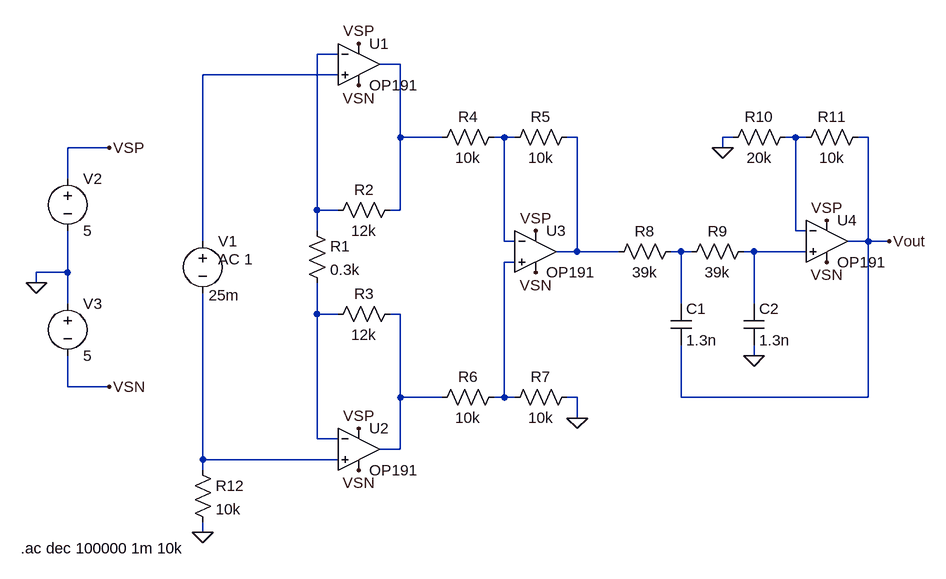
[diagram p0: schematic 323CA_Oprea_Olivia_Maria_Magdalena.asc]
323CA_Oprea_Olivia_Maria_Magdalena.asc, the LTspice schematic file:
Version 4
SHEET 1 1364 680
WIRE 352 -176 320 -176
WIRE 448 -160 416 -160
WIRE 352 -144 144 -144
WIRE 448 -48 448 -160
WIRE 512 -48 448 -48
WIRE 608 -48 592 -48
WIRE 624 -48 608 -48
WIRE 720 -48 704 -48
WIRE 960 -48 944 -48
WIRE 1056 -48 1040 -48
WIRE 1072 -48 1056 -48
WIRE 1168 -48 1152 -48
WIRE 0 -32 -64 -32
WIRE 944 -32 944 -48
WIRE -64 16 -64 -32
WIRE 320 64 320 -176
WIRE 352 64 320 64
WIRE 448 64 448 -48
WIRE 448 64 432 64
WIRE 320 96 320 64
WIRE 1056 96 1056 -48
WIRE 1072 96 1056 96
WIRE 144 112 144 -144
WIRE 608 112 608 -48
WIRE 624 112 608 112
WIRE 1168 112 1168 -48
WIRE 1168 112 1136 112
WIRE 1200 112 1168 112
WIRE 720 128 720 -48
WIRE 720 128 688 128
WIRE 784 128 720 128
WIRE 880 128 864 128
WIRE 896 128 880 128
WIRE 992 128 976 128
WIRE 1072 128 992 128
WIRE 624 144 608 144
WIRE -64 160 -64 96
WIRE -64 160 -112 160
WIRE -112 176 -112 160
WIRE -64 208 -64 160
WIRE 880 208 880 128
WIRE 992 208 992 128
WIRE 320 224 320 176
WIRE 352 224 320 224
WIRE 448 224 432 224
WIRE 992 288 992 272
WIRE -64 336 -64 288
WIRE 0 336 -64 336
WIRE 448 352 448 224
WIRE 512 352 448 352
WIRE 608 352 608 144
WIRE 608 352 592 352
WIRE 624 352 608 352
WIRE 720 352 704 352
WIRE 880 352 880 272
WIRE 1168 352 1168 112
WIRE 1168 352 880 352
WIRE 720 384 720 352
WIRE 320 416 320 224
WIRE 352 416 320 416
WIRE 448 432 448 352
WIRE 448 432 416 432
WIRE 144 448 144 192
WIRE 352 448 144 448
WIRE 144 464 144 448
WIRE 144 560 144 544
FLAG -112 176 0
FLAG 144 560 0
FLAG 0 -32 VSP
FLAG 0 336 VSN
FLAG 384 -192 VSP
FLAG 384 400 VSP
FLAG 384 -128 VSN
FLAG 384 464 VSN
FLAG 720 384 0
FLAG 656 96 VSP
FLAG 656 160 VSN
FLAG 992 288 0
FLAG 1104 144 VSN
FLAG 1104 80 VSP
FLAG 944 -32 0
FLAG 1200 112 Vout
SYMBOL voltage 144 96 R0
WINDOW 3 9 99 Left 2
WINDOW 123 24 44 Left 2
WINDOW 39 0 0 Left 0
SYMATTR Value 25m
SYMATTR Value2 AC 1
SYMATTR InstName V1
SYMBOL voltage -64 0 R0
SYMATTR InstName V2
SYMATTR Value 5
SYMBOL voltage -64 192 R0
SYMATTR InstName V3
SYMATTR Value 5
SYMBOL res 128 448 R0
SYMATTR InstName R12
SYMATTR Value 10k
SYMBOL res 304 80 R0
SYMATTR InstName R1
SYMATTR Value 0.3k
SYMBOL res 448 48 R90
WINDOW 0 0 56 VBottom 2
WINDOW 3 32 56 VTop 2
SYMATTR InstName R2
SYMATTR Value 12k
SYMBOL res 448 208 R90
WINDOW 0 0 56 VBottom 2
WINDOW 3 32 56 VTop 2
SYMATTR InstName R3
SYMATTR Value 12k
SYMBOL res 608 -64 R90
WINDOW 0 0 56 VBottom 2
WINDOW 3 32 56 VTop 2
SYMATTR InstName R4
SYMATTR Value 10k
SYMBOL res 720 -64 R90
WINDOW 0 0 56 VBottom 2
WINDOW 3 32 56 VTop 2
SYMATTR InstName R5
SYMATTR Value 10k
SYMBOL res 608 336 R90
WINDOW 0 0 56 VBottom 2
WINDOW 3 32 56 VTop 2
SYMATTR InstName R6
SYMATTR Value 10k
SYMBOL res 720 336 R90
WINDOW 0 0 56 VBottom 2
WINDOW 3 32 56 VTop 2
SYMATTR InstName R7
SYMATTR Value 10k
SYMBOL res 880 112 R90
WINDOW 0 0 56 VBottom 2
WINDOW 3 32 56 VTop 2
SYMATTR InstName R8
SYMATTR Value 39k
SYMBOL res 992 112 R90
WINDOW 0 0 56 VBottom 2
WINDOW 3 32 56 VTop 2
SYMATTR InstName R9
SYMATTR Value 39k
SYMBOL cap 864 208 R0
SYMATTR InstName C1
SYMATTR Value 1.3n
SYMBOL cap 976 208 R0
SYMATTR InstName C2
SYMATTR Value 1.3n
SYMBOL res 1056 -64 R90
WINDOW 0 0 56 VBottom 2
WINDOW 3 32 56 VTop 2
SYMATTR InstName R10
SYMATTR Value 20k
SYMBOL res 1168 -64 R90
WINDOW 0 0 56 VBottom 2
WINDOW 3 32 56 VTop 2
SYMATTR InstName R11
SYMATTR Value 10k
SYMBOL Opamps\\OP191 384 -224 R0
SYMATTR InstName U1
SYMBOL Opamps\\OP191 384 368 R0
SYMATTR InstName U2
SYMBOL Opamps\\OP191 656 64 R0
SYMATTR InstName U3
SYMBOL Opamps\\OP191 1104 48 R0
SYMATTR InstName U4
TEXT -136 584 Left 2 !.ac dec 100000 1m 10k

The netlist it stands for:
* 323CA_Oprea_Olivia_Maria_Magdalena.asc
V1 N003 N012 25m AC 1
V2 VSP 0 5
V3 0 VSN 5
R12 N012 0 10k
R1 N001 N010 0.3k
R2 N002 N001 12k
R3 N011 N010 12k
R4 N004 N002 10k
R5 N005 N004 10k
R6 N009 N011 10k
R7 0 N009 10k
R8 N007 N005 39k
R9 N008 N007 39k
C1 N007 Vout 1.3n
C2 N008 0 1.3n
R10 N006 0 20k
R11 Vout N006 10k
XU1 N003 N001 VSP VSN N002 OP191  ; pins In+ In- V+ V- OUT
XU2 N012 N010 VSP VSN N011 OP191  ; pins In+ In- V+ V- OUT
XU3 N009 N004 VSP VSN N005 OP191  ; pins In+ In- V+ V- OUT
XU4 N008 N006 VSP VSN Vout OP191  ; pins In+ In- V+ V- OUT
.ac dec 100000 1m 10k
.lib ADI.lib
.backanno
.end